# Altium schematic sheet REFCLK.SchDoc: {Наименование}
size 420 x 297 mm; DocumentNumber: ПЛАС.ХХХХХХ.ХХХ ХХ; SheetNumber: {}; SheetTotal: {}; PageSetup: Record=PageOptions|CenterHorizontal=False|CenterVertical=False|PrintScale=0.95|XCorrection=0.00|YCorrection=0.00|PrintKind=1|BorderSize=5000000|LeftOffset=0|BottomOffset=0|Orientation=1|PaperLength=1000|PaperWidth=1000|Scale=100|PaperSource=15|PrintQuality=600|MediaType=1|DitherType=10|PaperKind=A4|PrintScaleMode=1; Rule: PcbType=ProtelPcb
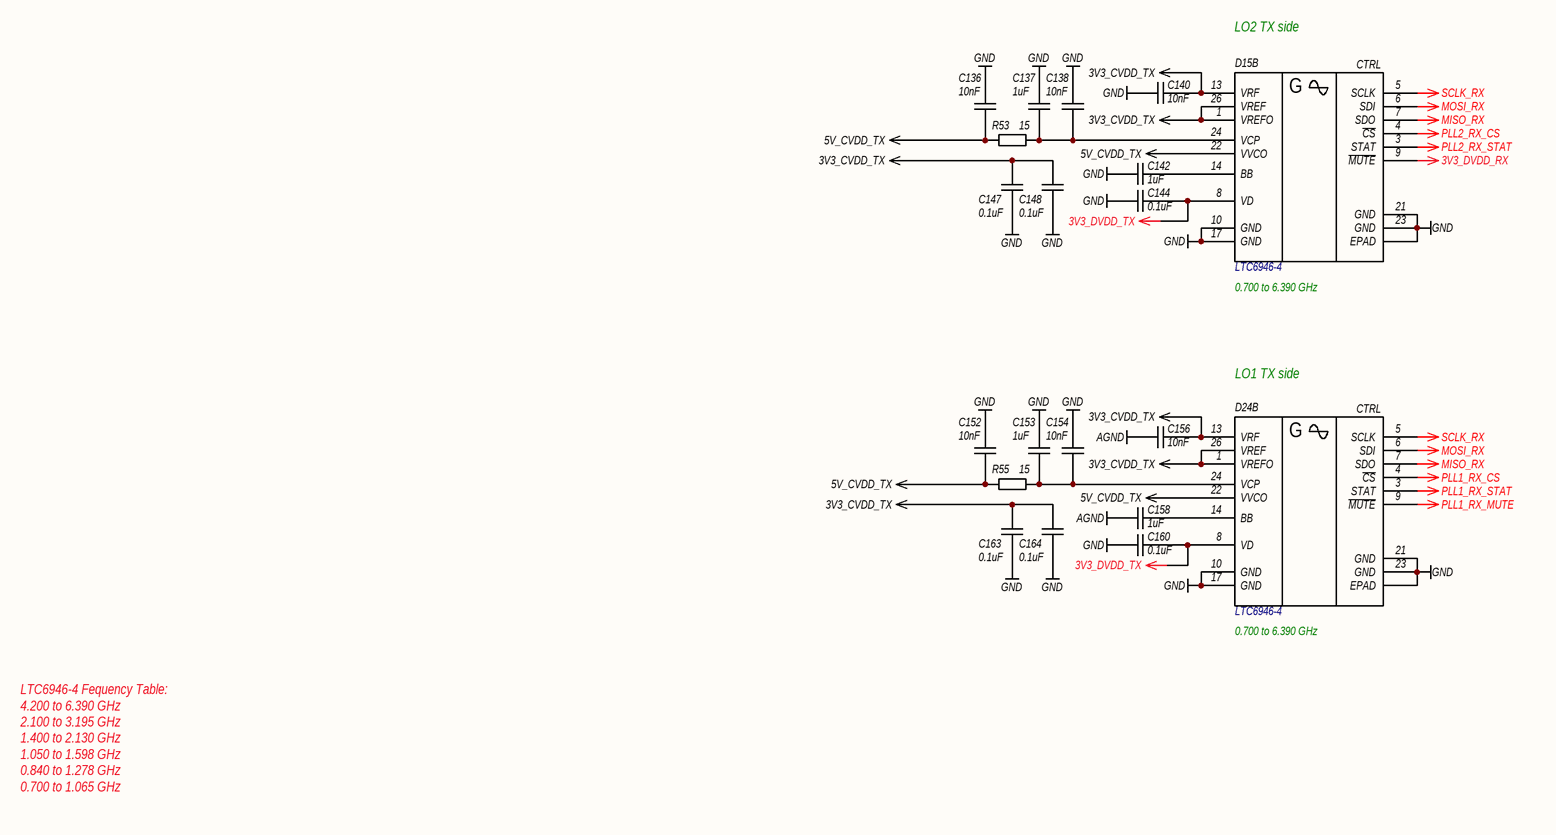
[diagram p0: REFCLK.SchDoc]

## Parts
C136  value 10nF  [C0402]  (hidden comment: CAP)
C137  value 1uF  [C0805]  (hidden comment: CAP)
C138  value 10nF  [C0402]  (hidden comment: CAP)
C140  value 10nF  [C0402]  (hidden comment: CAP)
C142  value 1uF  [C0805]  (hidden comment: CAP)
C144  value 0.1uF  [C0402]  (hidden comment: CAP)
C147  value 0.1uF  [C0402]  (hidden comment: CAP)
C148  value 0.1uF  [C0402]  (hidden comment: CAP)
C152  value 10nF  [C0402]  (hidden comment: CAP)
C153  value 1uF  [C0805]  (hidden comment: CAP)
C154  value 10nF  [C0402]  (hidden comment: CAP)
C156  value 10nF  [C0402]  (hidden comment: CAP)
C158  value 1uF  [C0805]  (hidden comment: CAP)
C160  value 0.1uF  [C0402]  (hidden comment: CAP)
C163  value 0.1uF  [C0402]  (hidden comment: CAP)
C164  value 0.1uF  [C0402]  (hidden comment: CAP)
D15  Name: LTC6946-4  Frequency Range: 0.700 to 6.390 GHz  [QFN-28]  (hidden comment: LTC6946)  (part B of 2)
D24  Name: LTC6946-4  Frequency Range: 0.700 to 6.390 GHz  [QFN-28]  (hidden comment: LTC6946)  (part B of 2)
R53  value 15  [R0603]  (hidden comment: RES)
R55  value 15  [R0603]  (hidden comment: RES)

## Nets
3V3_CVDD_TX: C140.1 C147.2 C148.2 C156.1 C163.2 C164.2 D15.1(VREFO) D15.13(VRF) D15.26(VREF) D24.1(VREFO) D24.13(VRF) D24.26(VREF)
3V3_DVDD_RX: D15.9(~{MUTE})
3V3_DVDD_TX: C144.2 C160.2 D15.8(VD) D24.8(VD)
5V_CVDD_TX: C136.2 C152.2 D15.22(VVCO) D24.22(VVCO) R53.2 R55.2
AGND: C156.2 C158.2
GND: C136.1 C137.1 C138.1 C140.2 C142.2 C144.1 C147.1 C148.1 C152.1 C153.1 C154.1 C160.1 C163.1 C164.1 D15.10(GND) D15.17(GND) D15.21(GND) D15.23(GND) D15.29(EPAD) D24.10(GND) D24.17(GND) D24.21(GND) D24.23(GND) D24.29(EPAD)
MISO_RX: D15.7(SDO) D24.7(SDO)
MOSI_RX: D15.6(SDI) D24.6(SDI)
PLL1_RX_CS: D24.4(~{CS})
PLL1_RX_MUTE: D24.9(~{MUTE})
PLL1_RX_STAT: D24.3(STAT)
PLL2_RX_CS: D15.4(~{CS})
PLL2_RX_STAT: D15.3(STAT)
SCLK_RX: D15.5(SCLK) D24.5(SCLK)
NetC137_2: C137.2 C138.2 D15.24(VCP) R53.1
NetC142_1: C142.1 D15.14(BB)
NetC153_2: C153.2 C154.2 D24.24(VCP) R55.1
NetC158_1: C158.1 D24.14(BB)

## Notes on the sheet
- LO2 TX side
- LO1 TX side
- LTC6946-4 Fequency Table:
  4.200 to 6.390 GHz
  2.100 to 3.195 GHz
  1.400 to 2.130 GHz
  1.050 to 1.598 GHz
  0.840 to 1.278 GHz
  0.700 to 1.065 GHz
- Подп. и дата
- Инв. № дубл.
- Взам. инв. №
- Инв. № подл.
- Лист
- Изм.
- № докум.
- Подп.
- Дата
- Копировал
- Формат А3
- (in symbol LTC6946, part B) CTRL; G

## Library data of the parts
C136 C138 C140 C152 C154 C156 = CAP: SMD Capacitor; Manufacturer: Murata; Material: X7R; Tolerance: 10%; Voltage: 25V; Type: Ceramic Capacitor; P/N: GRM155R71E103KA01D
C137 C142 C153 C158 = CAP: SMD Capacitor; Manufacturer: Murata; Material: X7R; Tolerance: 10%; Voltage: 10V; Type: Ceramic Capacitor; P/N: GRM21BR71A105KA01K
C144 C147 C148 C160 C163 C164 = CAP: SMD Capacitor; Manufacturer: Murata; Material: X7R; Tolerance: 10%; Voltage: 10V; Type: Ceramic Capacitor; P/N: GRM155R71A104KA01J
D15 D24 = LTC6946: The LTC®6946 is a high performance, low noise, 6.39GHz  phase-locked loop (PLL); Manufacturer: Linear Technology; Voltage: 3.15 V ~ 5.25 V; Type: Clock/Frequency Synthesizer (RF/IF), Integer N; P/N: LTC6946IUFD-4#PBF; Package: 28-QFN (4x5); Temperature Range: -40°C ~ 105°C; Supplier 1: Digi-Key; Supplier Part Number 1: LTC6946IUFD-4#PBF-ND
R53 R55 = RES: SMD Resistor; Name: Chip SMD Resistor; Power: 0.1 Wt; Tolerance: 1%; P/N: ERJ-3EKF15R0V; Temperature Range: -55…155°C